# EAGLE schematic relay-interface-for-vn5640 (EAGLE 9.6.2)
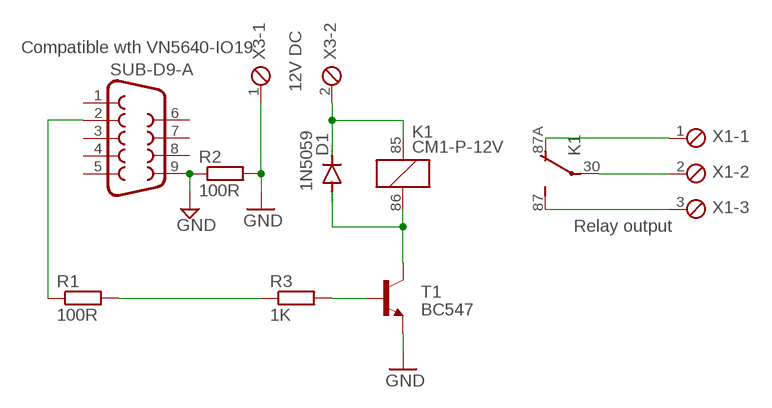
[diagram p0: schematic, sheet 1]

## Parts
D1  1N5059  [DO204-10]
K1  CM1-P-12V  [CM]
R1  100R  R-EU_0204/2V  [0204V]
R2  100R  R-EU_0204/2V  [0204V]
R3  1K  R-EU_0204/2V  [0204V]
SUB-D9-A  Compatible wth VN5640-IO19  F09H  [F09H]
T1  BC547  [TO92]
X1  Relay output  MPT3  [3POL254]
X3  12V DC  MPT2  [2POL254]

## Nets
GND: R2.1 R2.2 SUB-D9-A.9 T1.1(E) X3.1
N$1: D1.A K1.86 T1.3(C)
N$2: R3.2 T1.2(B)
N$3: D1.C K1.85 X3.2
N$4: R1.1 SUB-D9-A.2
N$5: R1.2 R3.1
N$6: K1.87A(2:O) X1.1
N$7: K1.30(2:P) X1.2
N$8: K1.87(2:S) X1.3
Unconnected: SUB-D9-A.1 SUB-D9-A.3 SUB-D9-A.4 SUB-D9-A.5 SUB-D9-A.6 SUB-D9-A.7 SUB-D9-A.8

## Library data of the parts
D1 = diode:1N5059: DIODE controlled avalanche rectifier
K1 = relay:CM1*: AUTOMOTIVE MICRO-ISO RELAY NAiS en_ds_61204_0000.pdf; MF: AROMAT/ MATSUSHITA; MPN: CM1-P-12V; OC_FARNELL: unknown; OC_NEWARK: 50B850
R1-R3 = rcl:R-EU_: RESISTOR, European symbol; SPICEPREFIX: R
SUB-D9-A = con-subd:F09: SUB-D; OC_FARNELL: unknown; OC_NEWARK: unknown
T1 = transistor:BC547: NPN TRANSISTOR
X1 = con-phoenix-254:MPT3: PHOENIX CONNECTOR; OC_FARNELL: unknown; OC_NEWARK: unknown
X3 = con-phoenix-254:MPT2: PHOENIX CONNECTOR; OC_FARNELL: unknown; OC_NEWARK: unknown